# EasyEDA Pro project ProPrj_机器狗_2025-04-21.epro

# Schematic Schematic1
Board Name: Board1; Create Date: 2025-04-21; Page Name: P1; Project Name: 机器狗; Schematic Name: Schematic1; Update Date: 2025-04-21; Company: 嘉立创EDA; Page Size: A4; Version: V1.0
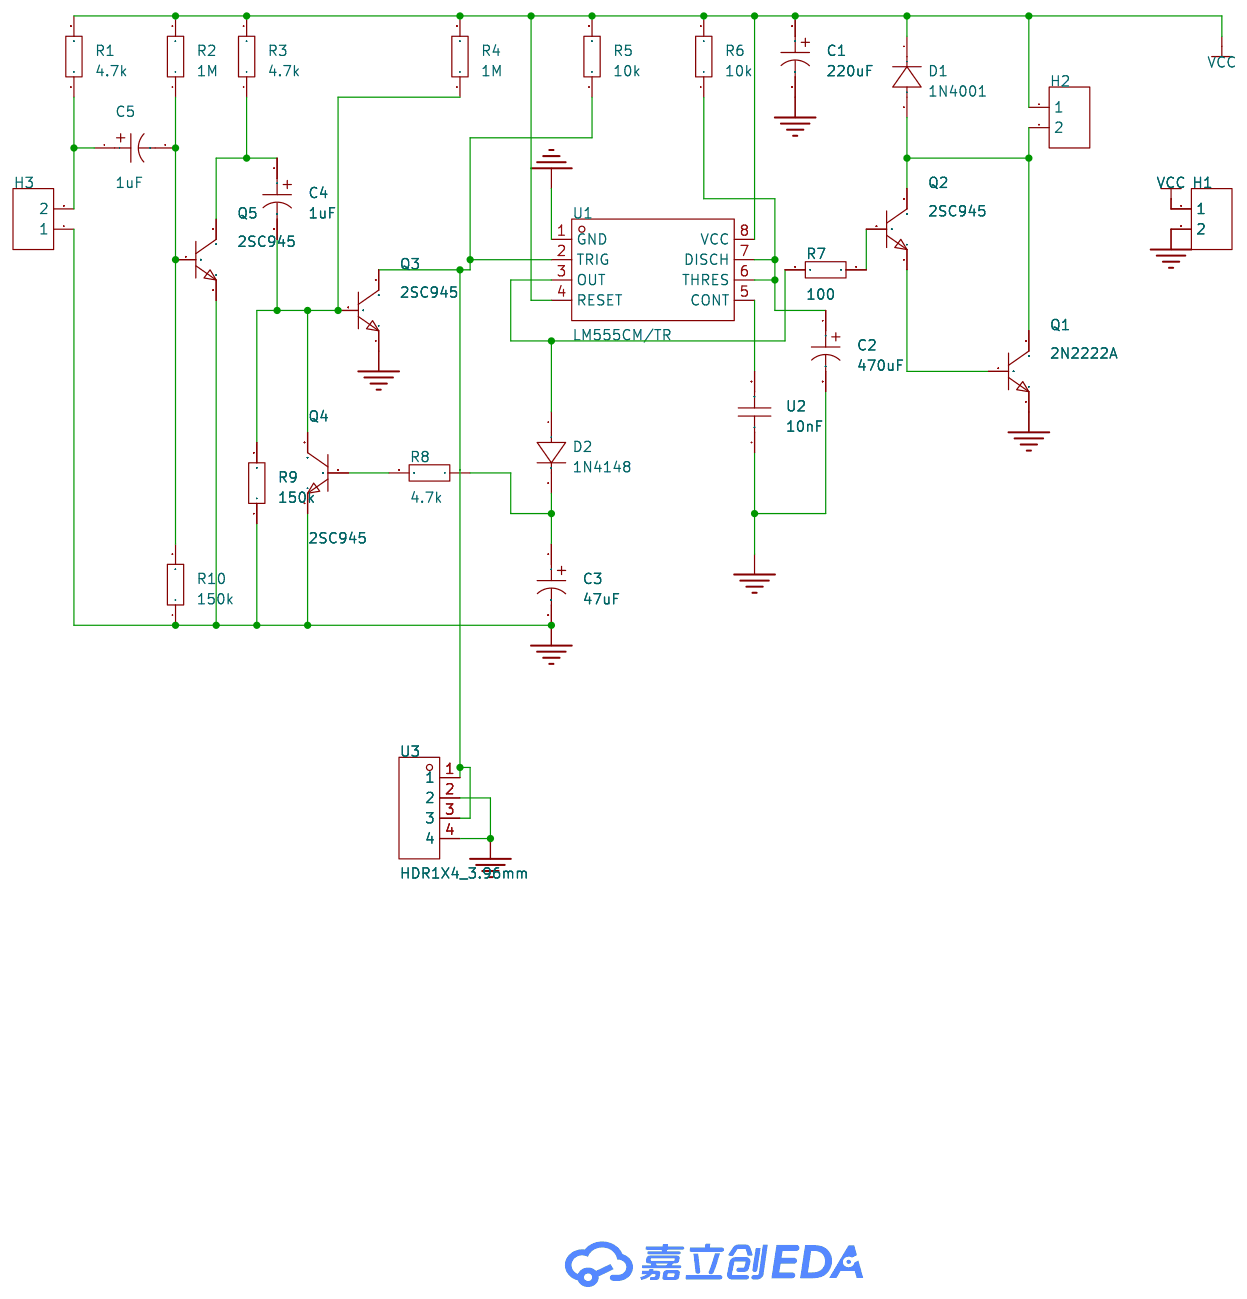
[diagram p0: schematic sheet]

## Parts
C1  220uF  [CAP-TH_BD8.0-P3.50-D0.6-FD]
C2  470uF  [CAP-TH_BD8.0-P5.00-D0.6-FD]
C3  47uF  [CAP-TH_BD6.3-P2.50-D0.5-FD]
C4  1uF  [CAP-TH_BD6.3-P2.50-D0.5-FD]
C5  1uF  [CAP-TH_BD6.3-P2.50-D0.5-FD]
D1  1N4001  [SMA_L4.3-W2.6-LS5.1-RD]
D2  1N4148  [DO-35_BD2.2-L4.0-D0.50_1N4148]
H1  -  [HDR-TH_2P-P2.54-V-F]
H2  -  [HDR-TH_2P-P2.54-V-F]
H3  -  [HDR-TH_2P-P2.54-V-F]
Q1  2N2222A  [TO-92-3_L4.9-W3.7-P1.27-L]
Q2  2SC945  [TO-92-3_L4.9-W3.7-P1.27-L]
Q3  2SC945  [TO-92-3_L4.9-W3.7-P1.27-L]
Q4  2SC945  [TO-92-3_L4.9-W3.7-P1.27-L]
Q5  2SC945  [TO-92-3_L4.9-W3.7-P1.27-L]
R1  4.7k  [R0603]
R2  1M  [R0603]
R3  4.7k  [R0603]
R4  1M  [R0603]
R5  10k  [R0603]
R6  10k  [R0603]
R7  100  [R0603]
R8  4.7k  [R0603]
R9  150k  [R0603]
R10  150k  [R0603]
U1  LM555CM/TR  [SOP-8_L4.9-W3.9-P1.27-LS6.0-BL-1]
U2  10nF  [C1206]
U3  HDR1X4_3.96mm  [CONN-TH_4P-P3.96_FWF39601-S04S22W1B]

## Library data of the parts
C1 = UKA1E221MPD1TD: 容值:220uF;精度:±20%;额定电压:25V;纹波电流:360mA@10kHz;等效串联电阻(ESR):-;; LCSC Part Name: 220uF ±20% 25V; Supplier Part: C1588801; Manufacturer: Nichicon(尼吉康); Supplier Footprint: 插件; JLCPCB Part Class: 扩展库; Datasheet: https://atta.szlcsc.com/upload/public/pdf/source/20220505/028EE900D47FF09CA318770E736AF0EB.pdf; Supplier: LCSC; Tolerance: ±20%; Voltage Rating: 25V; Ripple Current: 360mA@10kHz; Pin Spacing: 3.5mm; Diameter: 8mm; Lifetime: 2000hrs@105℃; Operating Temperature: -55℃~+105℃
C2 = ERR1EM471F12P50: 容值:470uF;精度:±20%;额定电压:25V;纹波电流:-;等效串联电阻:-;; LCSC Part Name: 470uF ±20% 25V; Supplier Part: C401511; Manufacturer: AISHI(艾华集团); Supplier Footprint: 插件,D8xL12mm; JLCPCB Part Class: 扩展库; Datasheet: https://atta.szlcsc.com/upload/public/pdf/source/20190702/C401591_1676EF45BC9A88BD1D6B22BBAE3913C7.pdf; Supplier: LCSC; Tolerance: ±20%; Rated Voltage: 25V; Lead Spacing: 5mm; φD: 8mm; L: 12mm; Lifetime @ Temp: 2000hrs@105℃
C3 = CD26G1JM470E120T: 容值:47uF;精度:±20%;额定电压:63V;纹波电流:-;等效串联电阻(ESR):-;; LCSC Part Name: 47uF ±20% 63V; Supplier Part: C46472512; Manufacturer: 创慧电子; Supplier Footprint: 插件,D6.3xL12mm; Datasheet: https://atta.szlcsc.com/upload/public/pdf/source/20250208/95E25F66E0D5629BBC6A4318C6E986E6.pdf; Supplier: LCSC; Tolerance: ±20%; Voltage Rating: 63V; Pin Spacing: 2.5mm; Diameter: 6.3mm; Height - Seated (Max): 12mm; Lifetime: 8000hrs@105℃; Operating Temperature: -40℃~+105℃
C4 C5 = UVR2E010MED: 容值:1uF;精度:±20%;额定电压:-;纹波电流:-;等效串联电阻:-;; LCSC Part Name: 1uF ±20% 停产 停产; Supplier Part: C445150; Manufacturer: Nichicon(尼吉康); Supplier Footprint: 插件,D6.3xL11mm; JLCPCB Part Class: 扩展库; Datasheet: https://atta.szlcsc.com/upload/public/pdf/source/20191118/C445215_2FA943EFC8385756780029ECA9D5B657.pdf; Supplier: LCSC; Tolerance: ±20%
D1 = 1N4001: Supplier Part: C9900008134; JLCPCB Part Class: 扩展库; Supplier: LCSC
D2 = 1N4148_C18195411: Supplier Part: C18195411; Manufacturer: LJ(朗捷); Supplier Footprint: DO-35; JLCPCB Part Class: 扩展库; Datasheet: https://atta.szlcsc.com/upload/public/pdf/source/20230921/E18EF32AEA6D96127C0687F4453A915D.pdf; Supplier: LCSC
H1-H3 = HDR-F_2.54_1x2P: Supplier Part: C49661; Supplier Footprint: 插件
Q1 = 2N2222A: 晶体管类型:NPN;集电极电流(Ic):600mA;集射极击穿电压(Vceo):40V;功率(Pd):625mW;直流电流增益(hFE@Ic,Vce):40@500mA,10V;; LCSC Part Name: NPN 电流:600mA 耐压:40V; Supplier Part: C118536; Manufacturer: ST(先科); Supplier Footprint: TO-92-3; JLCPCB Part Class: 扩展库; Datasheet: https://atta.szlcsc.com/upload/public/pdf/source/20170719/C118536_1500457734789828244.pdf; Supplier: LCSC; Transistor Type: NPN; Collector Current (Ic): 600mA; Collector-Emitter Breakdown Voltage (Vceo): 40V; Power Dissipation (Pd): 625mW; DC Current Gain (hFE@Ic,Vce): 40@500mA,10V; Transition Frequency (fT): 250MHz; Collector Cut-Off Current (Icbo): 10nA; Collector-Emitter Saturation Voltage (VCE(sat)@Ic,Ib): 1V@500mA,50mA
Q2-Q5 = 2SC945: LCSC Part Name: 三极管 停产; Supplier Part: C2987754; Manufacturer: ST(先科); Supplier Footprint: TO-92-3; JLCPCB Part Class: 扩展库; Datasheet: https://atta.szlcsc.com/upload/public/pdf/source/20220401/866B6C811E060AF67E1650FE9BEED438.pdf; Supplier: LCSC
R1-R10 = Res_0603: Supplier Footprint: 0603
U1 = LM555CM/TR: 定时器/计时器/时钟振荡器  高精度定时脉冲的双极性集成电路; Supplier Part: C19193453; Manufacturer: HGSEMI(华冠); Supplier Footprint: SOP-8; JLCPCB Part Class: 扩展库; Datasheet: https://atta.szlcsc.com/upload/public/pdf/source/20231208/7E463533ABE3BCE302E7015C37D3E91C.pdf; Supplier: LCSC
U2 = 10nF: Supplier Part: C9900088240; JLCPCB Part Class: 扩展库; Supplier: LCSC
U3 = HDR1X4_3.96mm: Supplier Part: C9900002236; Supplier Footprint: TH-4_8.2X15.84X3.96P; JLCPCB Part Class: 扩展库; Supplier: LCSC

## Nets
GND: C1.2 C2.2 C3.2 H1.2 H3.1 Q1.1(E) Q3.1(E) Q4.1(E) Q5.1(E) R9.1 R10.1 U1.1(GND) U2.1 U3.2 U3.4
VCC: C1.1 D1.1(K) H1.1 H2.1 R1.2 R2.2 R3.2 R4.2 R5.2 R6.2 U1.4(RESET) U1.8(VCC)
$1N1142: U1.5(CONT) U2.2
$1N1422: D2.1(A) R7.2 U1.3(OUT)
$1N1621: Q3.2(C) R5.1 U1.2(TRIG) U3.1 U3.3
Net-(C2-1): C2.1 R6.1 U1.6(THRES) U1.7(DISCH)
Net-(C3-1): C3.1 D2.2(C) R8.1
Net-(C4-1): C4.1 Q5.2(C) R3.1
Net-(C4-2): C4.2 Q3.3(B) Q4.2(C) R4.1 R9.2
Net-(C5-1): C5.1 H3.2 R1.1
Net-(C5-2): C5.2 Q5.3(B) R2.1 R10.2
Net-(D1-2): D1.2(A) H2.2 Q1.3(C) Q2.2(C)
Net-(Q1-2): Q1.2(B) Q2.1(E)
Net-(Q2-3): Q2.3(B) R7.1
Net-(Q4-3): Q4.3(B) R8.2

# Board PCB1
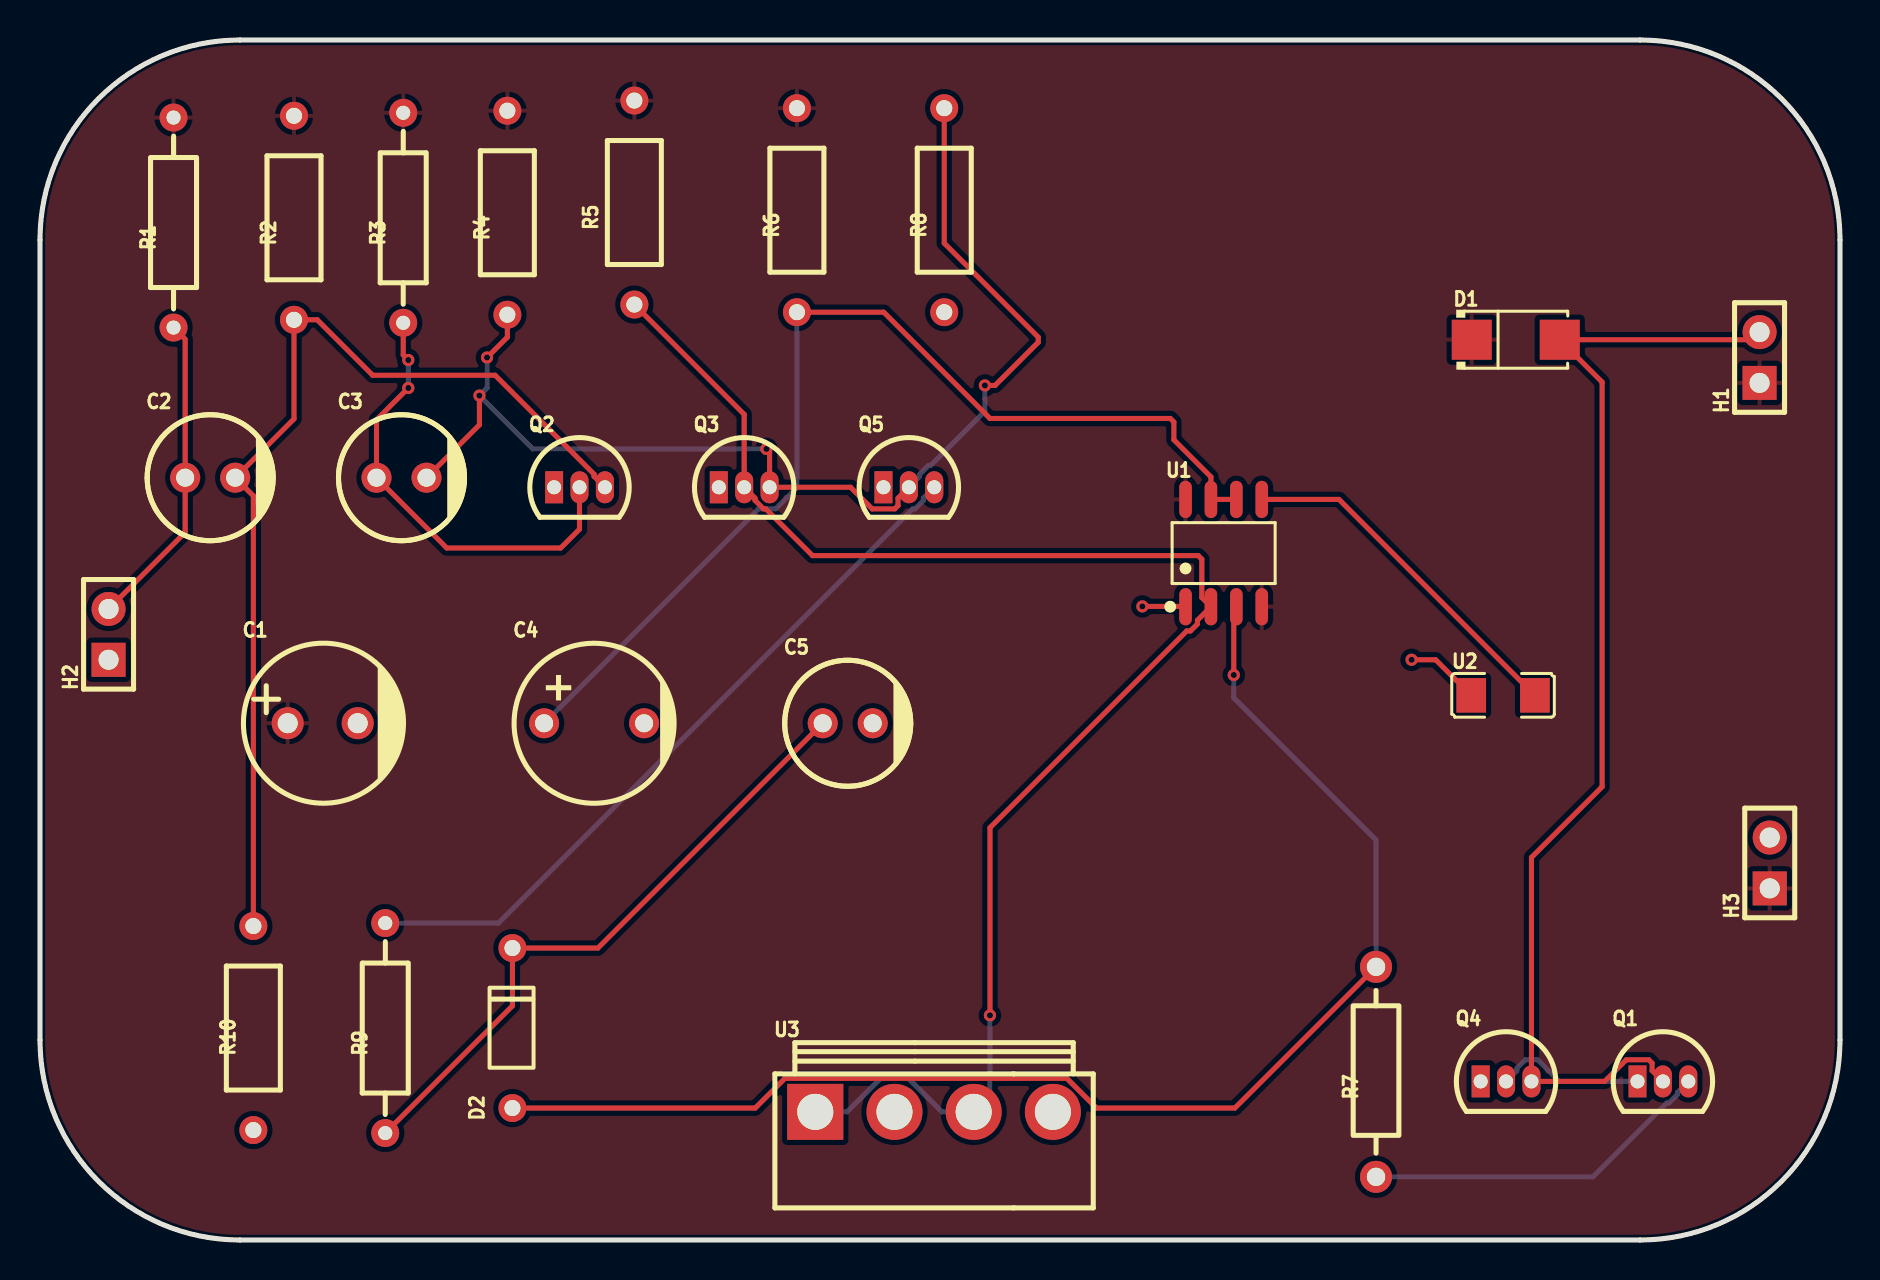
[diagram p1: board, top side]
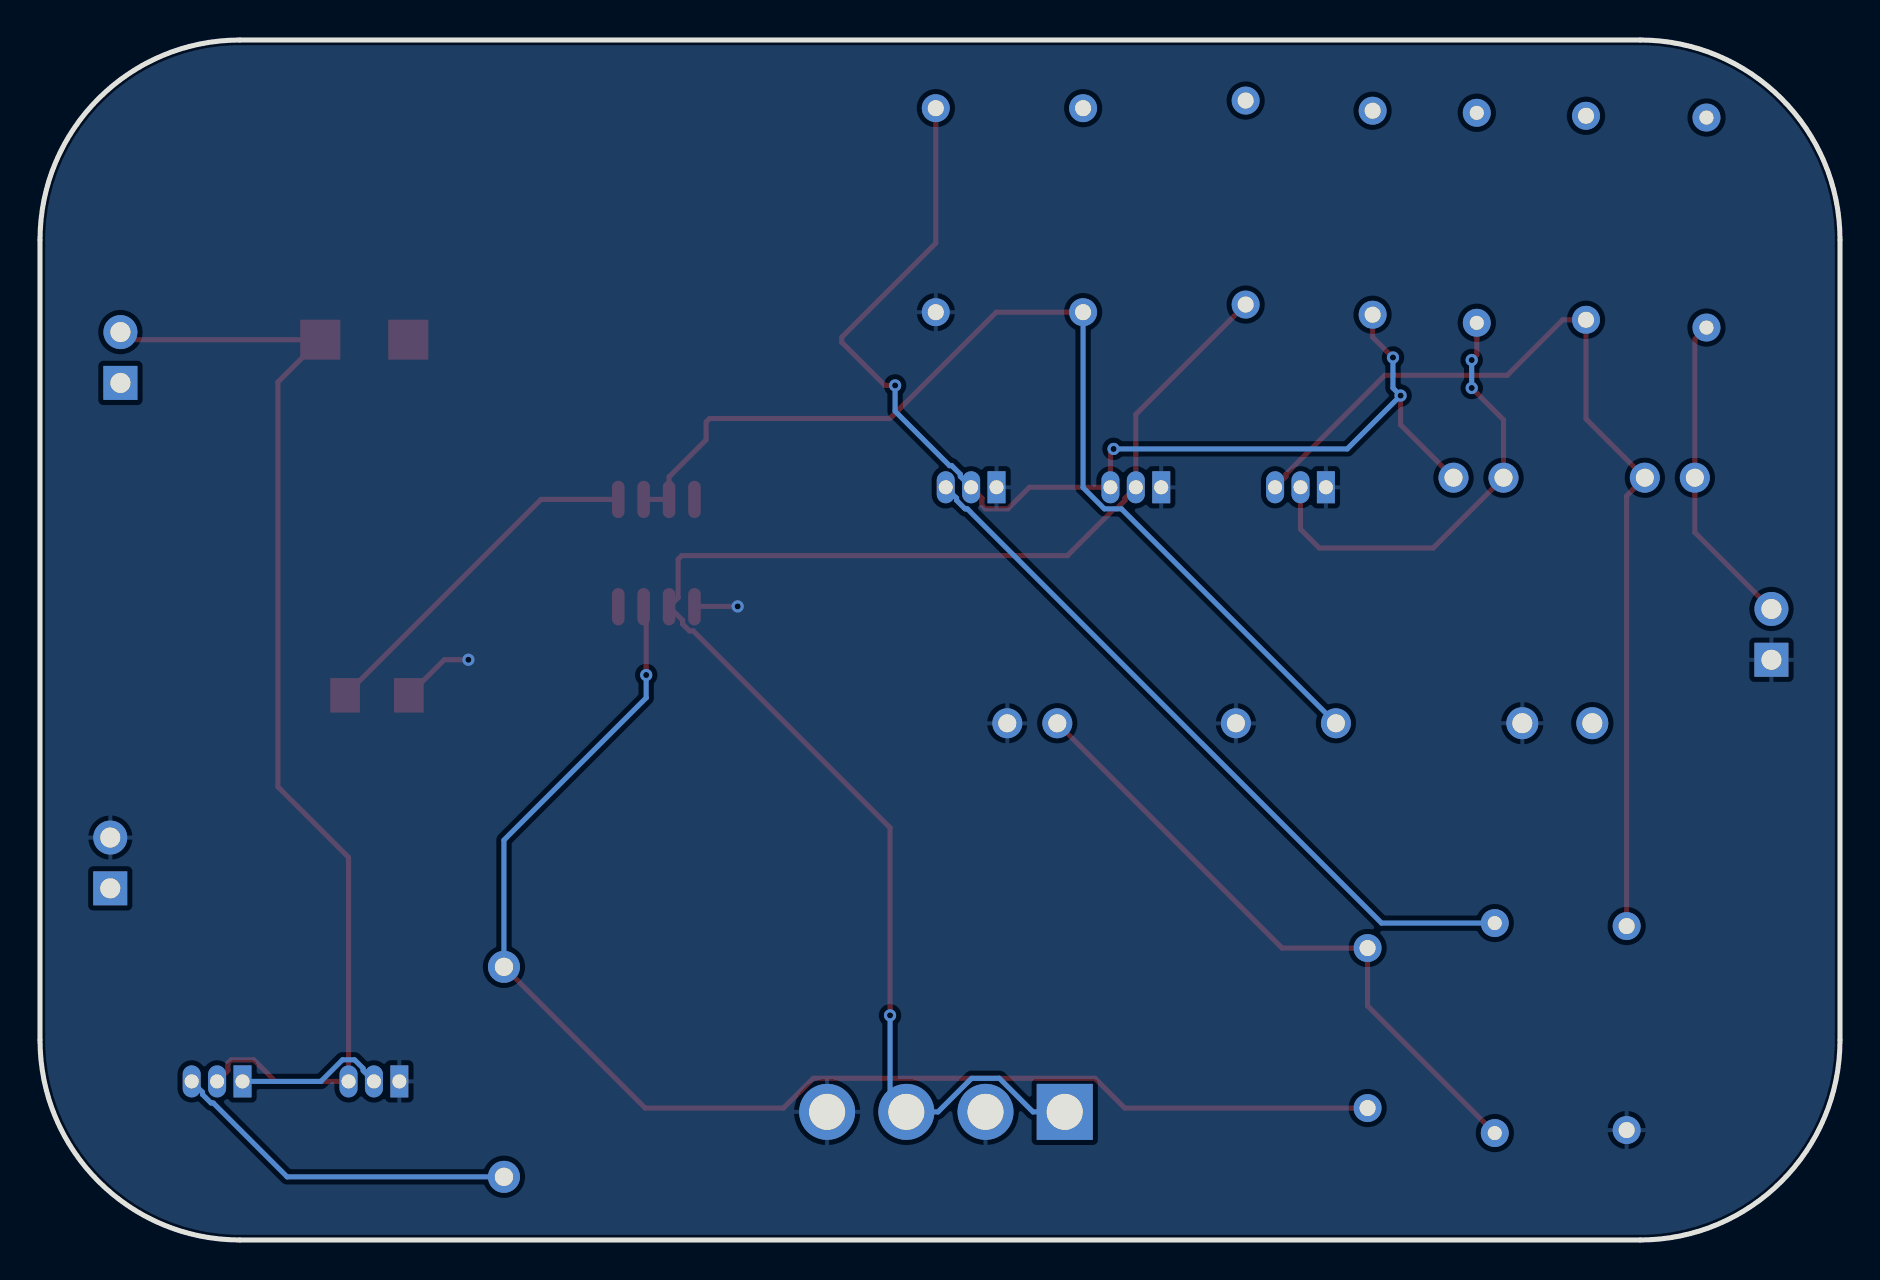
[diagram p2: board, bottom side, seen from below]

Outline 90 x 60 mm; copper layers: Top Layer, Bottom Layer. Coordinates in mm from the lower left corner of the outline.
Outline path: 0,50 0,10 arc(2.93,2.93) 10,0 80,0 arc(87.07,2.93) 90,10 90,50 arc(87.07,57.07) 80,60 10,60 arc(2.93,57.07) 0,50
Stack: Top Layer 0.035mm / Dielectric1 1.51mm FR4 er 4.5 / Bottom Layer 0.035mm

## Design rules (mm)
template: JLCPCB Capability(Two Layers Board)
spacing copperThickness1oz (default): track to track 0.102, other pairs 0.152 to 0.3
spacing copperThickness2oz: track to track 0.203, other pairs 0.152 to 0.3
track width copperThickness1oz (default): min 0.127, default 0.254, max 2.54
track width copperThickness2oz: min 0.203, default 0.254, max 2.54
differential pair differentialPair (default): width min 0.127, default 0.254, max 2.54; gap min 0.152, default 0.152
via viaSize (default): diameter min 0.5, default 0.61, max 10; hole min 0.3, default 0.305, max 6.3

## Placement (name value [footprint] x y rotation side)
C1  220uF  [CAP-TH_BD8.0-P3.50-D0.6-FD]  14.14 25.84 0 top
C2  470uF  [CAP-TH_BD6.3-P2.50-D0.5-FD]  8.51 38.11 0 top
C3  47uF  [CAP-TH_BD6.3-P2.50-D0.5-FD]  18.08 38.11 0 top
C4  1uF  [CAP-TH_BD8.0-P5.00-D0.6-FD]  27.7 25.84 0 top
C5  1uF  [CAP-TH_BD6.3-P2.50-D0.5-FD]  40.39 25.84 0 top
D1  1N4001  [SMA_L4.3-W2.6-LS5.1-RD]  73.79 45.01 0 top
D2  1N4148  [DO-35_BD2.2-L4.0-D0.50_1N4148]  23.62 10.6 90 top
H1  2.54-1*2P母  [HDR-TH_2P-P2.54-V-F]  85.98 44.12 90 top
H2  2.54-1*2P母  [HDR-TH_2P-P2.54-V-F]  3.43 30.28 90 top
H3  2.54-1*2P母  [HDR-TH_2P-P2.54-V-F]  86.49 18.85 90 top
Q1  2N2222A  [TO-92-3_L4.9-W3.7-P1.27-L]  81.15 7.93 0 top
Q2  2SC945  [TO-92-3_L4.9-W3.7-P1.27-L]  26.97 37.64 0 top
Q3  2SC945  [TO-92-3_L4.9-W3.7-P1.27-L]  35.21 37.64 0 top
Q4  2SC945  [TO-92-3_L4.9-W3.7-P1.27-L]  73.3 7.93 0 top
Q5  2SC945  [TO-92-3_L4.9-W3.7-P1.27-L]  43.44 37.64 0 top
R1  4.7k  [RES-TH_BD2.3-L6.5-P10.50-D0.5]  6.68 50.87 90 top
R2  1M  [RES-TH_BD2.7-L6.2-P10.20-D0.4]  12.7 51.11 90 top
R3  4.7k  [RES-TH_BD2.3-L6.5-P10.50-D0.5]  18.16 51.11 90 top
R4  1M  [RES-TH_BD2.7-L6.2-P10.20-D0.4]  23.37 51.36 90 top
R5  10k  [RES-TH_BD2.7-L6.2-P10.20-D0.4]  29.72 51.87 90 top
R6  10k  [RES-TH_BD2.7-L6.2-P10.20-D0.4]  37.85 51.49 90 top
R7  100  [RES-TH_BD2.2-L6.5-P10.50-D0.6]  66.8 8.41 90 top
R8  4.7k  [RES-TH_BD2.7-L6.2-P10.20-D0.4]  45.21 51.49 90 top
R9  150k  [RES-TH_BD2.3-L6.5-P10.50-D0.5]  17.26 10.6 90 top
R10  150k  [RES-TH_BD2.7-L6.2-P10.20-D0.4]  10.67 10.6 90 top
U1  LM555CM/TR  [SOP-8_L4.9-W3.9-P1.27-LS6.0-BL-1]  59.18 34.35 0 top
U2  10nF  [C1206]  73.15 27.23 0 top
U3  HDR1X4_3.96mm  [CONN-TH_4P-P3.96_FWF39601-S04S22W1B]  44.7 6.41 0 top

## Footprints (pads in the part's own frame, mm; a bottom-side part is the same pattern mirrored in y, then rotated)
C1206
  rect 1.485x1.728 smd: 1(-1.593,0) 2(1.593,0)
CAP-TH_BD6.3-P2.50-D0.5-FD
  round 1.5 hole 0.9: 1(-1.25,0) 2(1.25,0)
CAP-TH_BD8.0-P3.50-D0.6-FD
  round 1.6 hole 1: 1(-1.75,0) 2(1.75,0)
CAP-TH_BD8.0-P5.00-D0.6-FD
  round 1.5 hole 0.9: 1(-2.5,0) 2(2.5,0)
CONN-TH_4P-P3.96_FWF39601-S04S22W1B
  rect 2.8x2.8 hole 1.8: 1(-5.94,0)
  round 2.8 hole 1.8: 2(-1.98,0) 3(1.98,0) 4(5.94,0)
DO-35_BD2.2-L4.0-D0.50_1N4148
  round 1.4 hole 0.8: 1(-4,0) 2(4,0)
HDR-TH_2P-P2.54-V-F
  rect 1.7x1.7 hole 1: 1(-1.27,0)
  round 1.7 hole 1: 2(1.27,0)
RES-TH_BD2.2-L6.5-P10.50-D0.6
  round 1.6 hole 0.914: 1(-5.25,0) 2(5.25,0)
RES-TH_BD2.3-L6.5-P10.50-D0.5
  round 1.4 hole 0.7: 1(-5.25,0) 2(5.25,0)
RES-TH_BD2.7-L6.2-P10.20-D0.4
  round 1.4 hole 0.8: 1(-5.1,0) 2(5.1,0)
SMA_L4.3-W2.6-LS5.1-RD
  rect 2x2 smd: 1(-2.2,0) 2(2.2,0)
SOP-8_L4.9-W3.9-P1.27-LS6.0-BL-1
  oval 0.63x1.865 smd: 1(-1.905,-2.683) 2(-0.635,-2.683) 3(0.635,-2.683) 4(1.905,-2.683) 5(1.905,2.683) 6(0.635,2.683) 7(-0.635,2.683) 8(-1.905,2.683)
TO-92-3_L4.9-W3.7-P1.27-L
  rect 0.9x1.6 hole 0.7: 1(-1.27,0)
  oval 0.9x1.6 hole 0.7: 2(0,0) 3(1.27,0)

## Nets
GND: C1.2 C4.2 C5.2 H2.1 H3.2 Q2.1 Q3.1 Q4.1 Q5.1 R8.1 R10.1 U1.1 U2.1 U3.2 U3.4
VCC: C1.1 D1.1 H1.1 H3.1 R1.2 R2.2 R3.2 R4.2 R5.2 R6.2 U1.4 U1.8
$1N535: D1.2 H1.2 Q1.2 Q4.3
$1N752: Q1.1 Q4.2
$1N1142: U1.5 U2.2
$1N1203: C4.1 R6.1 U1.6 U1.7
$1N1422: D2.1 R7.2 U1.3
$1N1429: Q1.3 R7.1
$1N1586: C5.1 D2.2 R9.1
$1N1621: Q3.2 R5.1 U1.2 U3.1 U3.3
$1N2115: C3.2 Q3.3 Q5.2 R4.1 R8.2
$1N2177: Q5.3 R9.2
$1N2293: C3.1 Q2.2 R3.1
$1N2442: C2.2 Q2.3 R2.1 R10.2
$1N2488: C2.1 H2.2 R1.1

## Via types
v1: diameter 0.61, hole 0.305, Top Layer to Bottom Layer, 10 vias

## Routing (per net, layer and track width the routed paths; a pad name or vN(x,y) marks a point on that pad's centre or on a via; arc(x,y) is an arc through that point)
GND: length 5.9
  Top Layer w0.254: v1(55.12,31.68) 57.26,31.68 U1.1 ; v1(68.58,29.01) 69.78,29.01 U2.1
$1N535: length 57.3
  Top Layer w0.254: H1.2 85.6,45.01 D1.2 78.1,42.9 78.1,22.66 74.57,19.13 Q4.3 78.23,7.93 79.31,9.01 80.44,9.01 80.6,8.85 80.6,8.47 Q1.2
$1N752: length 7.5
  Bottom Layer w0.254: Q4.2 73.84,8.47 73.84,8.58 74.27,9.01 74.88,9.01 75.95,7.93 Q1.1
$1N1142: length 17.7
  Top Layer w0.254: U1.5 64.95,37.03 U2.2
$1N1203: length 53.3
  Top Layer w0.254: R6.1 42.18,46.39 47.5,41.08 56.51,41.08 56.69,40.9 56.69,40.01 58.55,38.16 U1.7 U1.6
  Bottom Layer w0.254: C4.1 35.93,36.56 36.78,36.56 37.85,37.62 R6.1
$1N1422: length 68.3
  Top Layer w0.254: U1.3 59.69,31.54 v1(59.69,28.25) ; R7.2 59.74,6.6 52.83,6.6 51.34,8.09 37.25,8.09 35.76,6.6 D2.1
  Bottom Layer w0.254: R7.2 66.8,20 59.69,27.11 v1(59.69,28.25)
$1N1429: length 17.7
  Bottom Layer w0.254: Q1.3 81.87,7.39 81.87,7.28 81.45,6.85 81.34,6.85 77.64,3.16 R7.1
$1N1586: length 32.1
  Top Layer w0.254: R9.1 23.62,11.71 23.62,14.6 27.9,14.6 C5.1
$1N1621: length 78
  Top Layer w0.254: v1(47.5,11.23) 47.5,20.61 57.34,30.45 57.52,30.45 57.87,30.8 57.87,30.99 U1.2 58.09,32.12 58.09,34.04 57.91,34.22 38.63,34.22 36.29,36.56 36.18,36.56 35.75,36.98 35.75,37.1 Q3.2 35.21,41.28 R5.1
  Bottom Layer w0.254: U3.1 40.35,6.41 42.03,8.09 43.42,8.09 45.1,6.41 U3.3 47.5,7.22 v1(47.5,11.23)
$1N2115: length 59.3
  Top Layer w0.254: Q5.2 42.9,37.1 42.9,36.72 42.74,36.56 41.61,36.56 40.53,37.64 Q3.3 36.48,39.4 v1(36.32,39.55) ; R4.1 23.37,45.14 v1(22.35,44.12) ; R8.2 45.21,49.84 49.91,45.14 49.91,44.89 47.75,42.73 v1(47.24,42.73) ; v1(21.97,42.22) 21.97,40.76 C3.2
  Bottom Layer w0.254: v1(36.32,39.55) 24.64,39.55 v1(21.97,42.22) 22.35,42.6 v1(22.35,44.12) ; v1(47.24,42.73) 47.24,41.44 44.52,38.72 44.41,38.72 43.98,38.29 43.98,38.18 Q5.2
$1N2177: length 36.5
  Bottom Layer w0.254: R9.2 22.92,15.85 43.63,36.56 43.75,36.56 44.17,36.98 44.17,37.1 44.71,37.64
$1N2293: length 22.6
  Top Layer w0.254: v1(18.42,44) 18.16,44.25 R3.1 ; v1(18.42,42.6) 16.83,41.01 C3.1 20.34,34.6 26.03,34.6 26.97,35.54 Q2.2
  Bottom Layer w0.254: v1(18.42,44) v1(18.42,42.6)
$1N2442: length 51
  Top Layer w0.254: Q2.3 27.7,38.18 27.7,38.29 22.76,43.24 16.64,43.24 13.86,46.01 R2.1 12.7,41.06 C2.2 10.67,37.21 R10.2
$1N2488: length 15.9
  Top Layer w0.254: H2.2 7.26,35.38 C2.1 7.26,45.04 R1.1

## Copper pours and planes (outline as drawn; the poured copper is in the pictures)
GND on Bottom Layer: -3.17,61.78 95.12,61.78 95.12,-3.75 -3.17,-3.75
VCC on Top Layer: -2.16,61.27 91.06,61.27 91.06,-0.45 -2.16,-0.45
